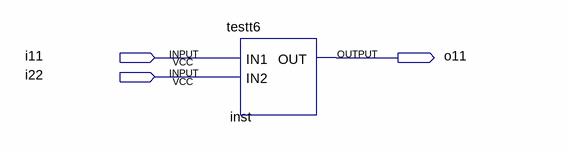
[diagram p0: schematic sheet]
// Quartus schematic Block2111.bdf as structural Verilog: 1 symbols, 3 pins
module Block2111 (
  input  i11,
  input  i22,
  output o11
);

  testt6 inst (.IN1(i11), .IN2(i22), .OUT(o11));
endmodule
